# EAGLE design microlux (EAGLE 8.4.3)

## Sheet 1 of 3: Microcontoller, USB & ST4
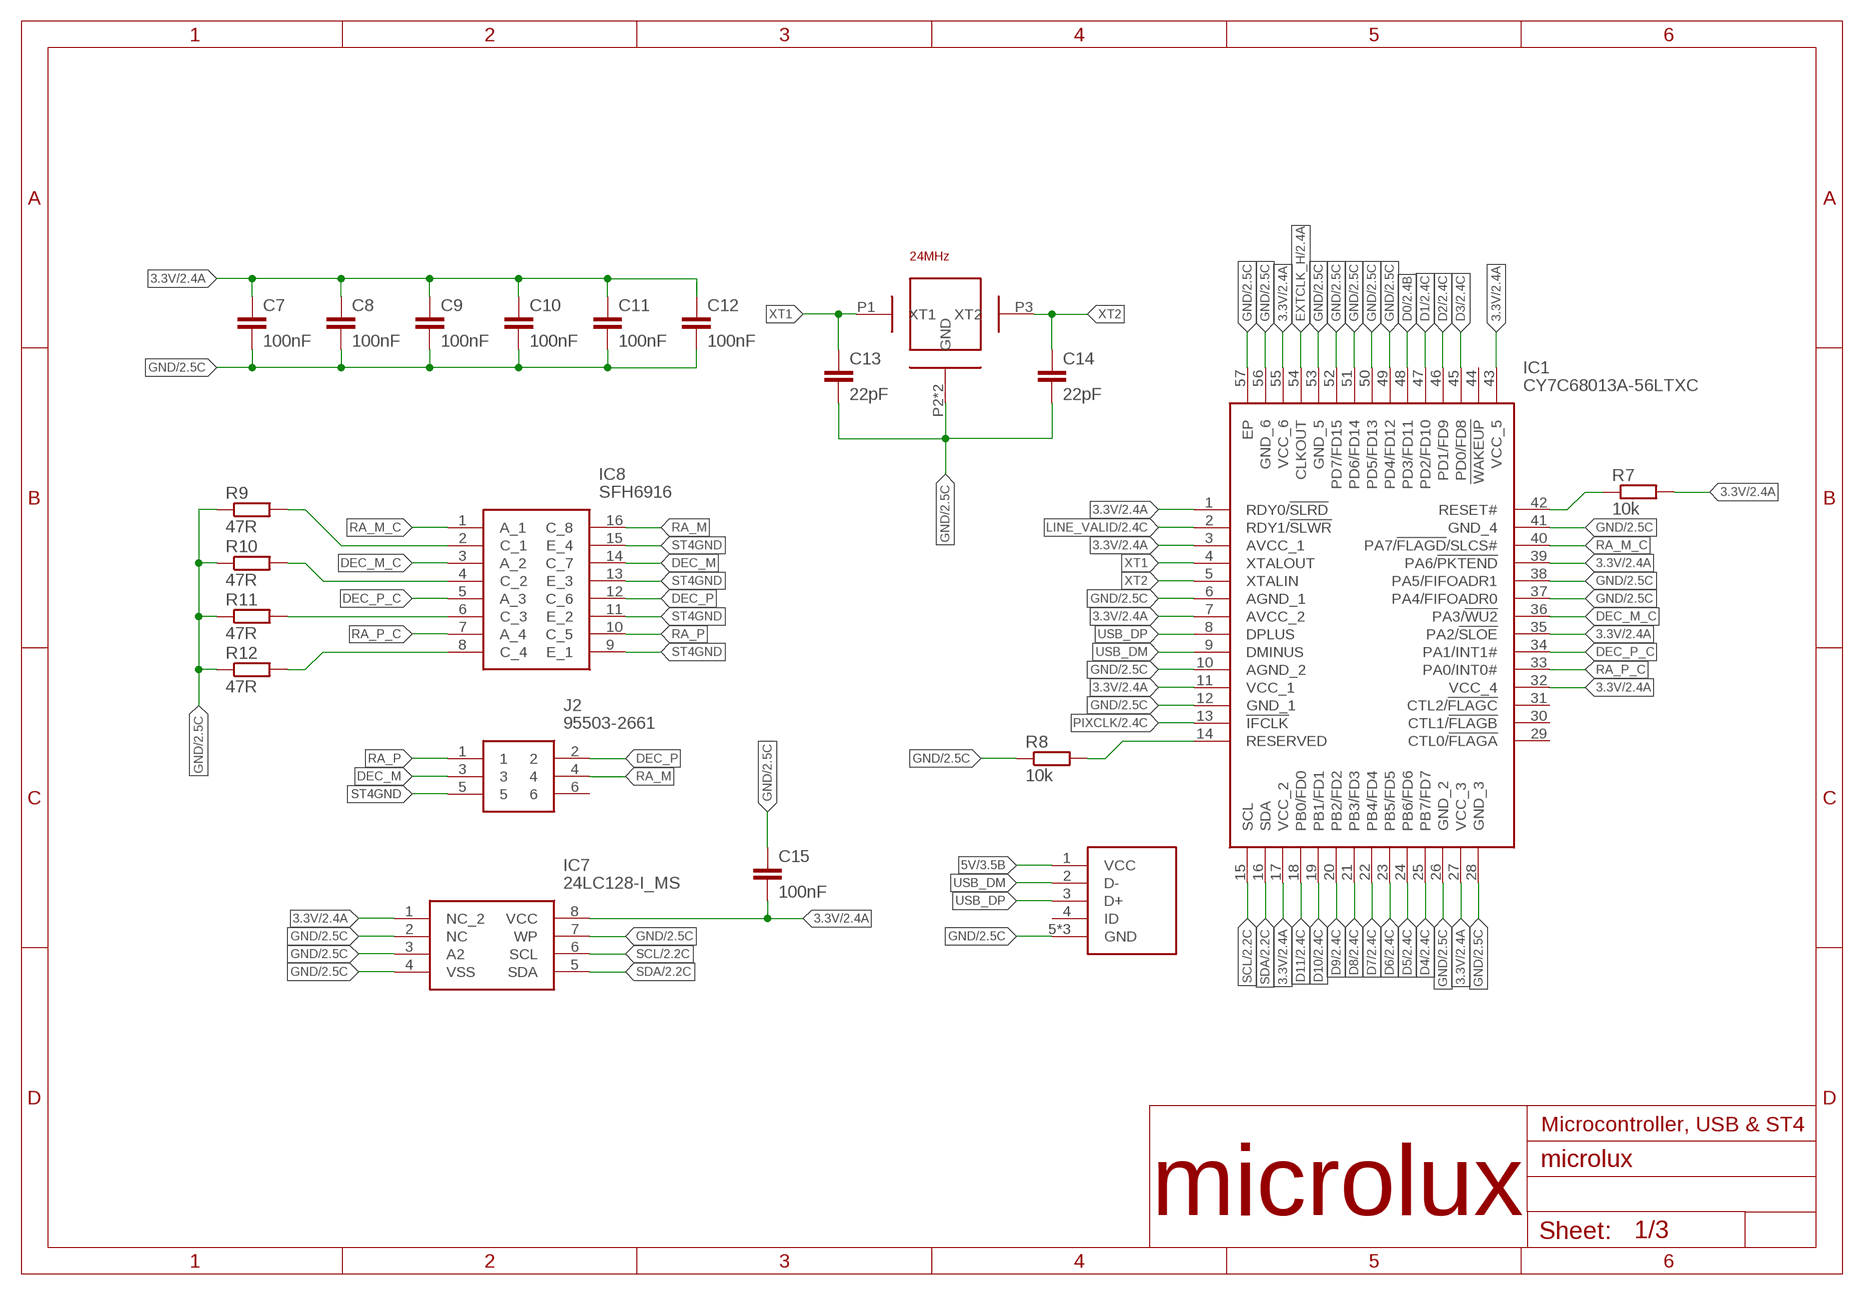
[diagram p0: schematic, sheet 1]

### Parts
C7  100nF  C-EUC0603  [C0603]
C8  100nF  C-EUC0603  [C0603]
C9  100nF  C-EUC0603  [C0603]
C10  100nF  C-EUC0603  [C0603]
C11  100nF  C-EUC0603  [C0603]
C12  100nF  C-EUC0603  [C0603]
C13  22pF  C-EUC0603  [C0603]
C14  22pF  C-EUC0603  [C0603]
C15  100nF  C-EUC0603  [C0603]
IC1  CY7C68013A-56LTXC  [QFN50P800X800X100-57N]
IC7  24LC128-I_MS  [SOP65P490X110-8N]
IC8  SFH6916  [SOIC127P686X216-16N]
J1  614105150621  [VMUSB]
J2  95503-2661  [955032661]
R7  10k  R-EU_R0603  [R0603]
R8  10k  R-EU_R0603  [R0603]
R9  47R  R-EU_R0603  [R0603]
R10  47R  R-EU_R0603  [R0603]
R11  47R  R-EU_R0603  [R0603]
R12  47R  R-EU_R0603  [R0603]
X1  24MHz  3.2X2.5_SHIELDED_CRYSTAL  [3.2X2.5]

### Nets
3.3V: C7.1 C8.1 C9.1 C10.1 C11.1 C12.1 C15.2 IC1.1(RDY0/!SLRD) IC1.3(AVCC_1) IC1.7(AVCC_2) IC1.11(VCC_1) IC1.17(VCC_2) IC1.27(VCC_3) IC1.32(VCC_4) IC1.35(PA2/!SLOE) IC1.39(PA6/!PKTEND) IC1.43(VCC_5) IC1.55(VCC_6) IC7.1(NC_2) IC7.8(VCC) R7.2 ; also sheet 2,3
5V: J1.1(VCC) ; also sheet 3
D0: IC1.48(PD3/FD11) ; also sheet 2
D1: IC1.47(PD2/FD10) ; also sheet 2
D2: IC1.46(PD1/FD9) ; also sheet 2
D3: IC1.45(PD0/FD8) ; also sheet 2
D4: IC1.25(PB7/FD7) ; also sheet 2
D5: IC1.24(PB6/FD6) ; also sheet 2
D6: IC1.23(PB5/FD5) ; also sheet 2
D7: IC1.22(PB4/FD4) ; also sheet 2
D8: IC1.21(PB3/FD3) ; also sheet 2
D9: IC1.20(PB2/FD2) ; also sheet 2
D10: IC1.19(PB1/FD1) ; also sheet 2
D11: IC1.18(PB0/FD0) ; also sheet 2
DEC_M: IC8.14(C_7) J2.3
DEC_M_C: IC1.36(PA3/!WU2) IC8.3(A_2)
DEC_P: IC8.12(C_6) J2.2
DEC_P_C: IC1.34(PA1/INT1#) IC8.5(A_3)
EXTCLK_H: IC1.54(CLKOUT) ; also sheet 2
GND: C7.2 C8.2 C9.2 C10.2 C11.2 C12.2 C13.2 C14.2 C15.1 IC1.6(AGND_1) IC1.10(AGND_2) IC1.12(GND_1) IC1.26(GND_2) IC1.28(GND_3) IC1.37(PA4/FIFOADR0) IC1.38(PA5/FIFOADR1) IC1.41(GND_4) IC1.49(PD4/FD12) IC1.50(PD5/FD13) IC1.51(PD6/FD14) IC1.52(PD7/FD15) IC1.53(GND_5) IC1.56(GND_6) IC1.57(EP) IC7.2(NC) IC7.3(A2) IC7.4(VSS) IC7.7(WP) J1.5(GND) J1.M1(GND) J1.M2(GND) R8.1 R9.1 R10.1 R11.1 R12.1 X1.P2(GND) X1.P4(GND) ; also sheet 2,3
LINE_VALID: IC1.2(RDY1/!SLWR) ; also sheet 2
N$1: IC1.14(RESERVED) R8.2
N$2: IC8.2(C_1) R9.2
N$4: IC1.42(RESET#) R7.1
N$5: IC8.4(C_2) R10.2
N$6: IC8.6(C_3) R11.2
N$7: IC8.8(C_4) R12.2
PIXCLK: IC1.13(!IFCLK) ; also sheet 2
RA_M: IC8.16(C_8) J2.4
RA_M_C: IC1.40(PA7/!FLAGD!/SLCS#) IC8.1(A_1)
RA_P: IC8.10(C_5) J2.1
RA_P_C: IC1.33(PA0/INT0#) IC8.7(A_4)
SCL: IC1.15(SCL) IC7.6(SCL) ; also sheet 2
SDA: IC1.16(SDA) IC7.5(SDA) ; also sheet 2
ST4GND: IC8.9(E_1) IC8.11(E_2) IC8.13(E_3) IC8.15(E_4) J2.5
USB_DM: IC1.9(DMINUS) J1.2(D-)
USB_DP: IC1.8(DPLUS) J1.3(D+)
XT1: C13.1 IC1.4(XTALOUT) X1.P1(XT1)
XT2: C14.1 IC1.5(XTALIN) X1.P3(XT2)
Unconnected: IC1.29(CTL0/!FLAGA) IC1.30(CTL1/!FLAGB) IC1.31(CTL2/!FLAGC) IC1.44(!WAKEUP) J1.4(ID) J2.6

### Notes on the sheet
- Microcontroller, USB & ST4
- microlux

## Sheet 2 of 3: Image sensor & LLS
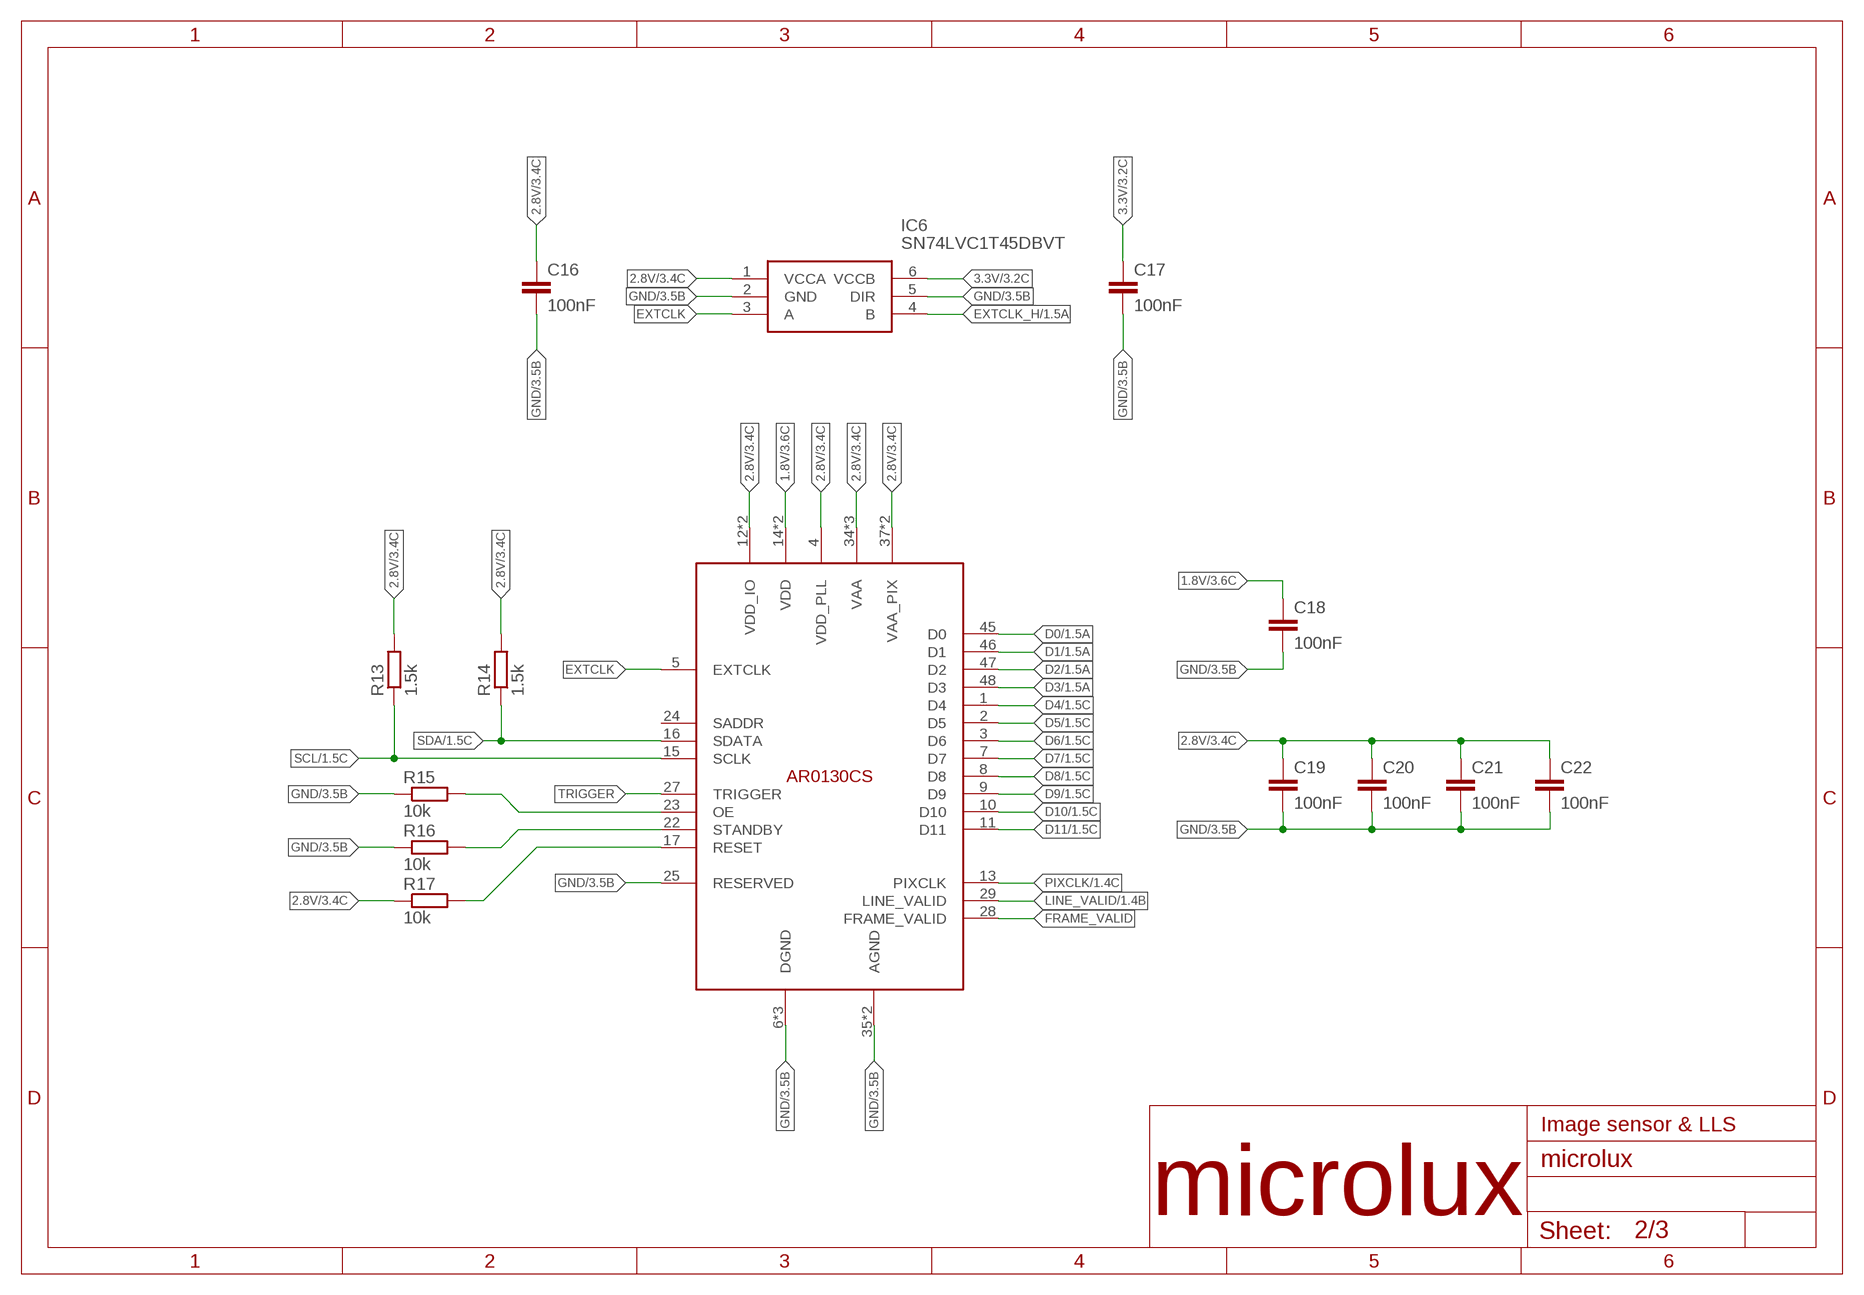
[diagram p1: schematic, sheet 2]

### Parts
C16  100nF  C-EUC0603  [C0603]
C17  100nF  C-EUC0603  [C0603]
C18  100nF  C-EUC0603  [C0603]
C19  100nF  C-EUC0603  [C0603]
C20  100nF  C-EUC0603  [C0603]
C21  100nF  C-EUC0603  [C0603]
C22  100nF  C-EUC0603  [C0603]
IC2  AR0130CS-ILCC48  [ILCC48]
IC6  SN74LVC1T45DBVT  [SOT95P280X145-6N]
R13  1.5k  R-EU_R0603  [R0603]
R14  1.5k  R-EU_R0603  [R0603]
R15  10k  R-EU_R0603  [R0603]
R16  10k  R-EU_R0603  [R0603]
R17  10k  R-EU_R0603  [R0603]

### Nets
1.8V: C18.1 IC2.14(VDD) IC2.19(VDD) ; also sheet 3
2.8V: C16.1 C19.1 C20.1 C21.1 C22.1 IC2.4(VDD_PLL) IC2.12(VDD_IO) IC2.18(VDD_IO) IC2.34(VAA) IC2.36(VAA) IC2.37(VAA_PIX) IC2.38(VAA_PIX) IC2.40(VAA) IC6.1(VCCA) R13.2 R14.2 R17.1 ; also sheet 3
3.3V: C17.1 IC6.6(VCCB) ; also sheet 1,3
D0: IC2.45(D0) ; also sheet 1
D1: IC2.46(D1) ; also sheet 1
D2: IC2.47(D2) ; also sheet 1
D3: IC2.48(D3) ; also sheet 1
D4: IC2.1(D4) ; also sheet 1
D5: IC2.2(D5) ; also sheet 1
D6: IC2.3(D6) ; also sheet 1
D7: IC2.7(D7) ; also sheet 1
D8: IC2.8(D8) ; also sheet 1
D9: IC2.9(D9) ; also sheet 1
D10: IC2.10(D10) ; also sheet 1
D11: IC2.11(D11) ; also sheet 1
EXTCLK: IC2.5(EXTCLK) IC6.3(A)
EXTCLK_H: IC6.4(B) ; also sheet 1
FRAME_VALID: IC2.28(FRAME_VALID)
GND: C16.2 C17.2 C18.2 C19.2 C20.2 C21.2 C22.2 IC2.6(DGND) IC2.25(RESERVED) IC2.30(DGND) IC2.35(AGND) IC2.39(AGND) IC2.44(DGND) IC6.2(GND) IC6.5(DIR) R15.1 R16.1 ; also sheet 1,3
LINE_VALID: IC2.29(LINE_VALID) ; also sheet 1
N$3: IC2.23(OE) R15.2
N$8: IC2.22(STANDBY) R16.2
N$21: IC2.17(RESET) R17.2
PIXCLK: IC2.13(PIXCLK) ; also sheet 1
SCL: IC2.15(SCLK) R13.1 ; also sheet 1
SDA: IC2.16(SDATA) R14.1 ; also sheet 1
TRIGGER: IC2.27(TRIGGER)
Unconnected: IC2.24(SADDR)

### Notes on the sheet
- Image sensor & LLS
- microlux

## Sheet 3 of 3: Voltage regulators
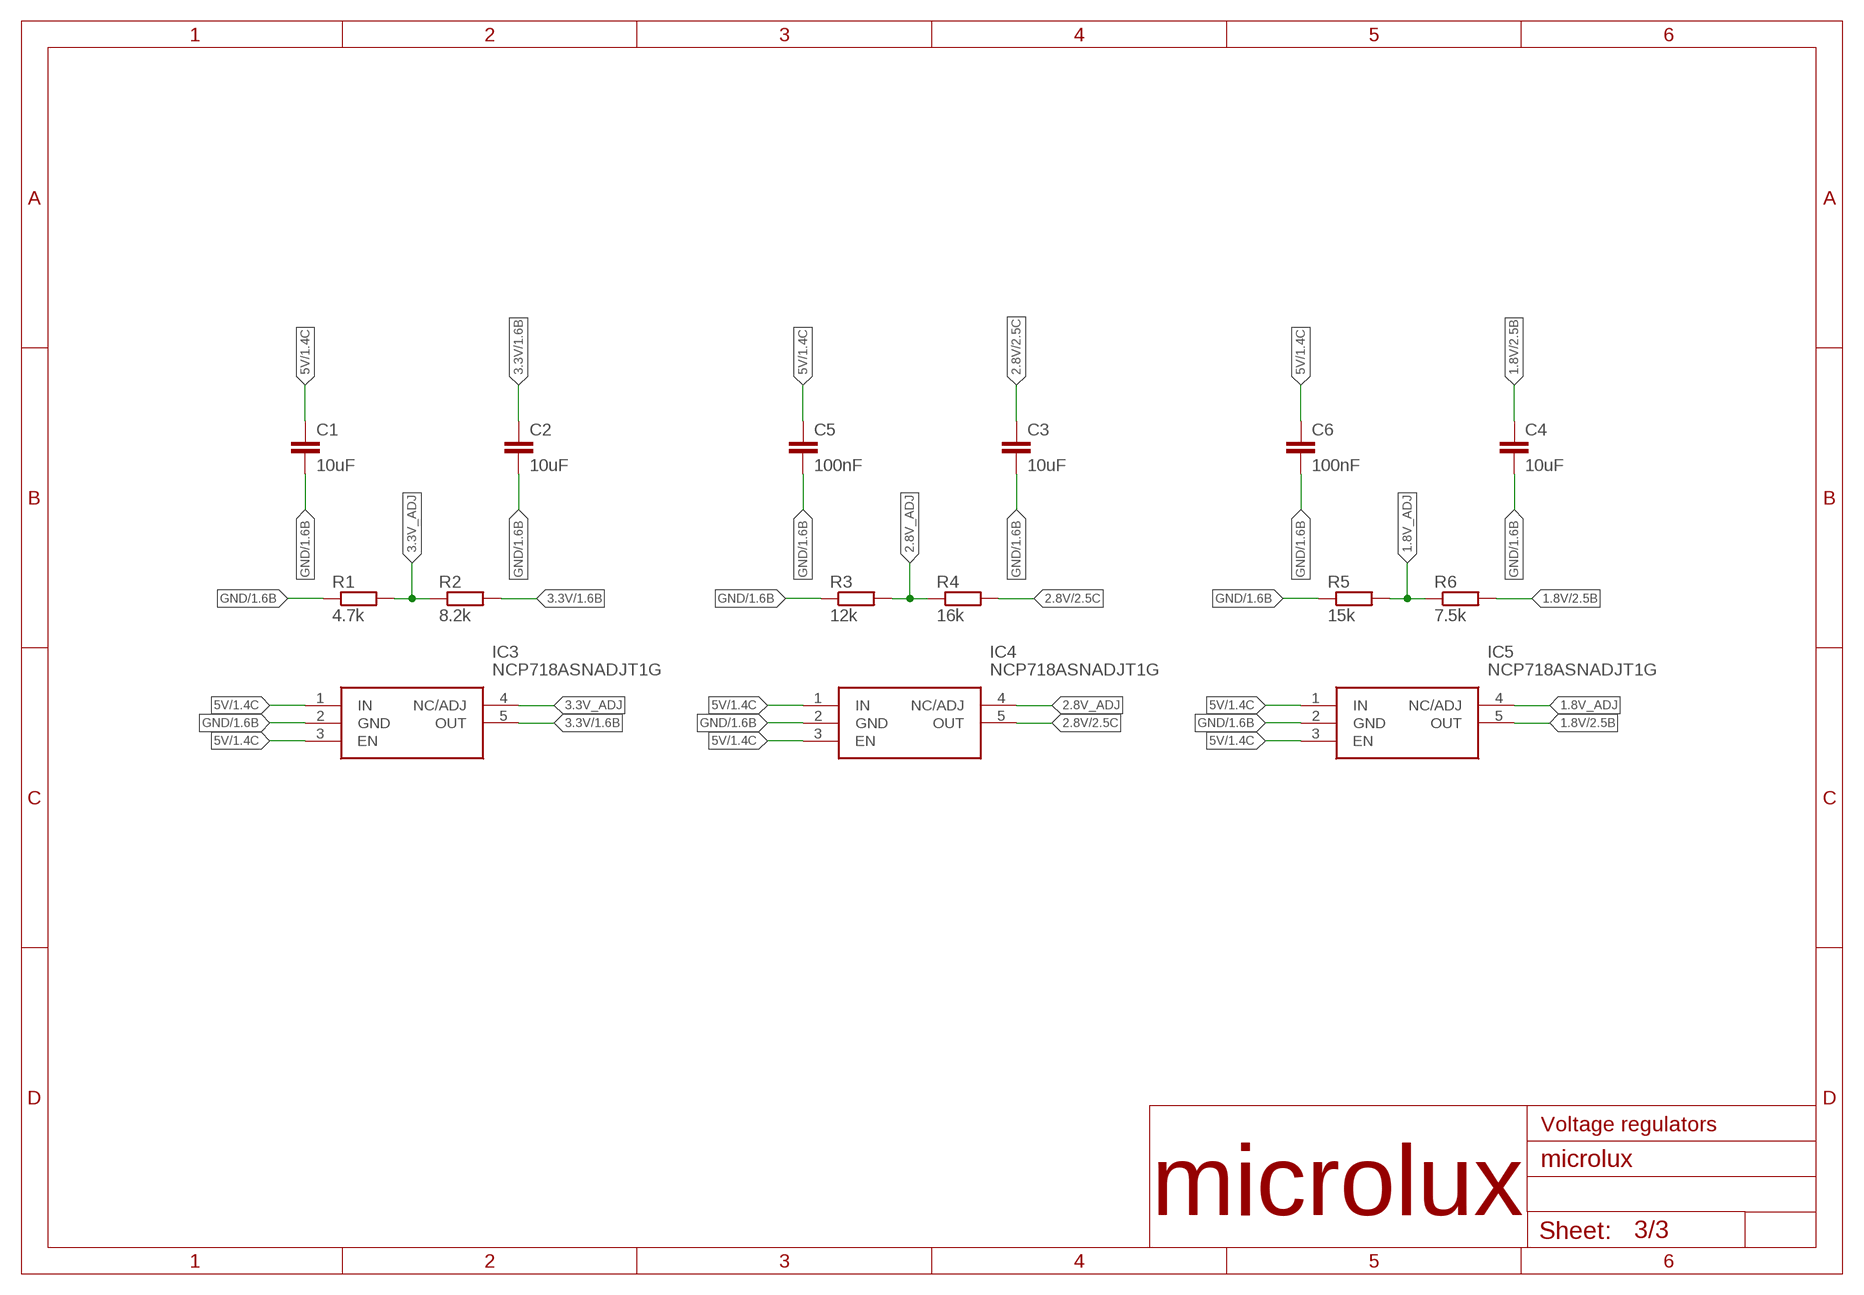
[diagram p2: schematic, sheet 3]

### Parts
C1  10uF  C-EUC1210  [C1210]
C2  10uF  C-EUC1210  [C1210]
C3  10uF  C-EUC1210  [C1210]
C4  10uF  C-EUC1210  [C1210]
C5  100nF  C-EUC0603  [C0603]
C6  100nF  C-EUC0603  [C0603]
IC3  NCP718ASNADJT1G  [SOT95P280X100-5N]
IC4  NCP718ASNADJT1G  [SOT95P280X100-5N]
IC5  NCP718ASNADJT1G  [SOT95P280X100-5N]
R1  4.7k  R-EU_R0603  [R0603]
R2  8.2k  R-EU_R0603  [R0603]
R3  12k  R-EU_R0603  [R0603]
R4  16k  R-EU_R0603  [R0603]
R5  15k  R-EU_R0603  [R0603]
R6  7.5k  R-EU_R0603  [R0603]

### Nets
1.8V: C4.1 IC5.5(OUT) R6.2 ; also sheet 2
1.8V_ADJ: IC5.4(NC/ADJ) R5.2 R6.1
2.8V: C3.1 IC4.5(OUT) R4.2 ; also sheet 2
2.8V_ADJ: IC4.4(NC/ADJ) R3.2 R4.1
3.3V: C2.1 IC3.5(OUT) R2.2 ; also sheet 1,2
3.3V_ADJ: IC3.4(NC/ADJ) R1.2 R2.1
5V: C1.1 C5.1 C6.1 IC3.1(IN) IC3.3(EN) IC4.1(IN) IC4.3(EN) IC5.1(IN) IC5.3(EN) ; also sheet 1
GND: C1.2 C2.2 C3.2 C4.2 C5.2 C6.2 IC3.2(GND) IC4.2(GND) IC5.2(GND) R1.1 R3.1 R5.1 ; also sheet 1,2

### Notes on the sheet
- Voltage regulators
- microlux

## Library data of the parts
C1-C22 = rcl:C-EU: CAPACITOR, European symbol
IC1 = CY7C68013A-56LTXC:CY7C68013A-56LTXC: Cypress Semiconductor CY7C68013A-56LTXC, USB Controller, 480MBps, USB 2.0, 3.3 V, 56-Pin QFN Source: Datasheet <http://www.arrow.com/en/products/cy7c68013a-56ltxc/cypress-semiconductor>; ARROW_PART_NUMBER: CY7C68013A-56LTXC; ARROW_PRICE-STOCK: https://www.arrow.com/en/products/cy7c68013a-56ltxc/cypress-semiconductor; DESCRIPTION: Cypress Semiconductor CY7C68013A-56LTXC, USB Controller, 480MBps, USB 2.0, 3.3 V, 56-Pin QFN; HEIGHT: 1mm; MANUFACTURER_NAME: Cypress Semiconductor; MANUFACTURER_PART_NUMBER: CY7C68013A-56LTXC; RS_PART_NUMBER: 1254136P; RS_PRICE-STOCK: http://uk.rs-online.com/web/p/products/1254136P
IC2 = ar0130cs:AR0130CS-ILCC48
IC3-IC5 = NCP718ASNADJT1G:NCP718ASNADJT1G: LDO Regulator, 300 mA, Low Iq, Wide Input Voltage Adjustable, Active Discharge Source: Datasheet <http://www.onsemi.com/pub/Collateral/NCP718-D.PDF>; ARROW_PART_NUMBER: NCP718ASNADJT1G; ARROW_PRICE-STOCK: https://www.arrow.com/en/products/ncp718asnadjt1g/on-semiconductor; DESCRIPTION: LDO Regulator, 300 mA, Low Iq, Wide Input Voltage Adjustable, Active Discharge; HEIGHT: 1mm; MANUFACTURER_NAME: ON Semiconductor; MANUFACTURER_PART_NUMBER: NCP718ASNADJT1G; RS_PART_NUMBER: 1723327; RS_PRICE-STOCK: http://uk.rs-online.com/web/p/products/1723327
IC6 = SN74LVC1T45DBVT:SN74LVC1T45DBVT: Single-Bit Dual-Supply Bus Transceiver with Configurable Voltage-Level Shifting and 3-State Outputs Source: Datasheet <http://www.ti.com/lit/ds/symlink/sn74lvc1t45.pdf>; DESCRIPTION: Single-Bit Dual-Supply Bus Transceiver with Configurable Voltage-Level Shifting and 3-State Outputs; HEIGHT: 1.45mm; MANUFACTURER_NAME: Texas Instruments; MANUFACTURER_PART_NUMBER: SN74LVC1T45DBVT; MOUSER_PART_NUMBER: 595-SN74LVC1T45DBVT; MOUSER_PRICE-STOCK: https://www.mouser.com/Search/Refine.aspx?Keyword=595-SN74LVC1T45DBVT; RS_PART_NUMBER: 9222846; RS_PRICE-STOCK: http://uk.rs-online.com/web/p/products/9222846
IC7 = 24LC128-I_MS:24LC128-I_MS: 128K I2C CMOS Serial EEPROM Source: Datasheet <http://componentsearchengine.com/Datasheets/1/24LC128-I_MS.pdf>; ALLIED_NUMBER: 70045853; ALLIED_PRICE-STOCK: https://www.alliedelec.com/microchip-technology-inc-24lc128-i-ms/70045853/; ARROW_PART_NUMBER: 24LC128-I/MS; ARROW_PRICE-STOCK: https://www.arrow.com/en/products/24lc128-ims/microchip-technology; DESCRIPTION: 128K I2C CMOS Serial EEPROM; HEIGHT: mm; MANUFACTURER_NAME: Microchip; MANUFACTURER_PART_NUMBER: 24LC128-I/MS; RS_PART_NUMBER: 2509532705; RS_PRICE-STOCK: http://uk.rs-online.com/web/p/products/2509532705
IC8 = SFH6916:SFH6916: Optocoupler DC-IN 4-CH Trans DC-OUT Source: Datasheet <http://www.vishay.com/docs/83687/sfh6916.pdf>; ALLIED_NUMBER: R1084757; ALLIED_PRICE-STOCK: https://www.alliedelec.com/vishay-dale-sfh6916/R1084757/; ARROW_PART_NUMBER: SFH6916; ARROW_PRICE-STOCK: https://www.arrow.com/en/products/sfh6916/vishay; DESCRIPTION: Optocoupler DC-IN 4-CH Trans DC-OUT; HEIGHT: 2.16mm; MANUFACTURER_NAME: Vishay; MANUFACTURER_PART_NUMBER: SFH6916; RS_PART_NUMBER: 7085522P; RS_PRICE-STOCK: http://uk.rs-online.com/web/p/products/7085522P
J1 = vertusb:614105150621
J2 = 95503-2661:95503-2661: Molex 95503 Series 6 Way Straight Through Hole Unshielded RJ11 Jack 2661 Source: Datasheet <https://www.molex.com/pdm_docs/sd/955032661_sd.pdf>; ALLIED_NUMBER: 70091112; ALLIED_PRICE-STOCK: https://www.alliedelec.com/molex-incorporated-95503-2661/70091112/; ARROW_PART_NUMBER: 95503-2661; ARROW_PRICE-STOCK: http://uk.rs-online.com/web/p/products/8223220; DESCRIPTION: Molex 95503 Series 6 Way Straight Through Hole Unshielded RJ11 Jack 2661; HEIGHT: 15.7mm; MANUFACTURER_NAME: Molex; MANUFACTURER_PART_NUMBER: 95503-2661; RS_PART_NUMBER: 8223220; RS_PRICE-STOCK: http://uk.rs-online.com/web/p/products/8223220
R1-R17 = rcl:R-EU_: RESISTOR, European symbol
X1 = osc:3.2X2.5_SHIELDED_CRYSTAL

## Board
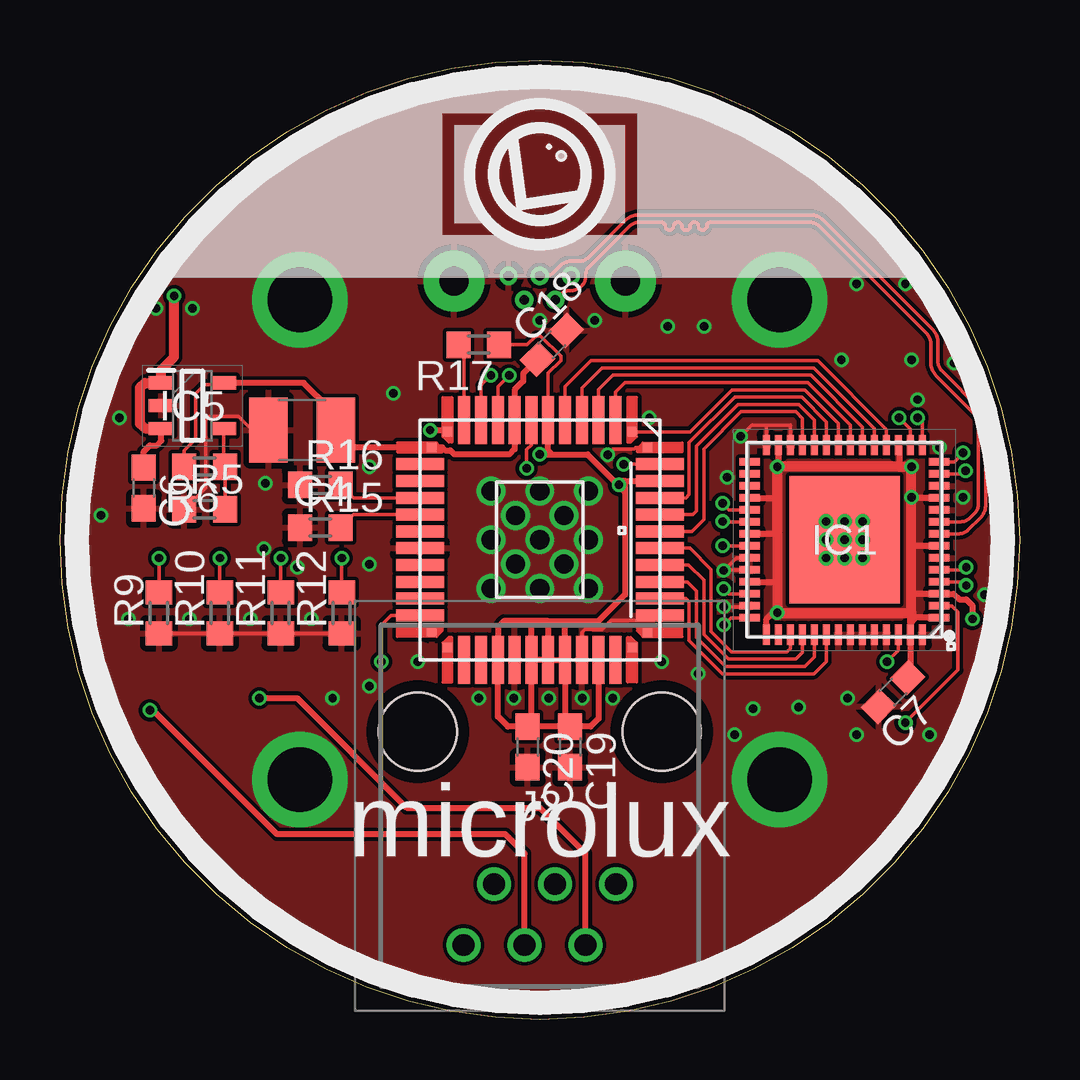
[diagram p3: board, top side]
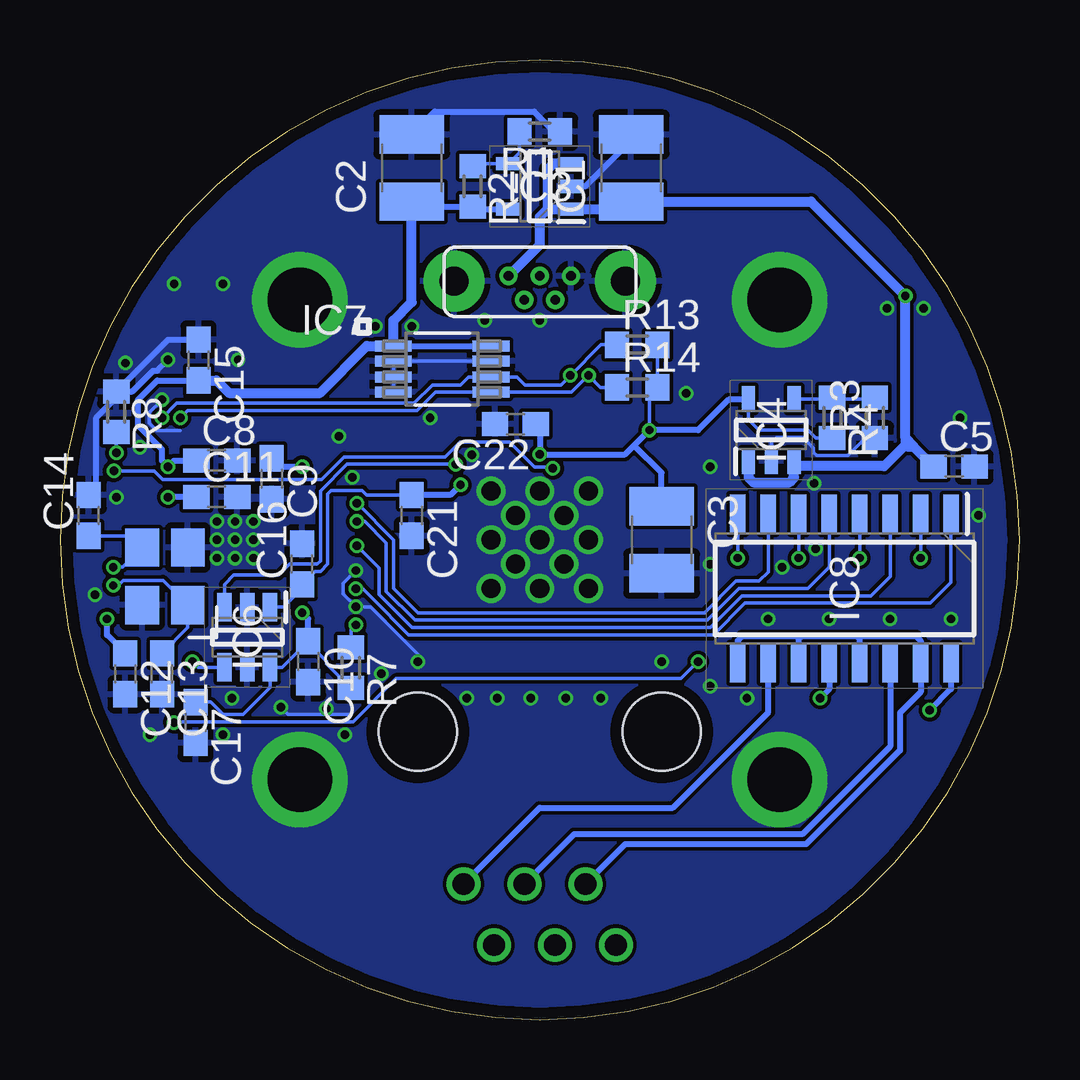
[diagram p4: board, bottom side, seen from below]

Size 40 x 40 mm. Coordinates in mm from the lower left corner, seen from the top.
Outline: 20,40 arc-90 40,20 arc-90 20,0 arc-90 0,20 arc-90 20,40
Copper layers (1*16): Top 0.035mm / dielectric 1.5mm / Bottom 0.035mm
Design rules "default *": minimum track width 6mil, minimum drill 0.35mm, track to track 6mil, track to pad 6mil, pad to pad 6mil, via to via 6mil, smd to smd 6mil, copper to edge 20mil, drill to drill 6mil, minimum pad ring 5mil, minimum via ring 5mil, stop-mask expansion 4mil, vias tented up to drill 15mil, thermal gap 10mil

### Footprints (pad centres in the part's own frame; a part is rotated, then mirrored left to right if it is on the bottom)
C1210 = smd 1.6 x 2.7: 1 -1.4,0; 2 1.4,0
C0603 = smd 1.1 x 1: 1 -0.85,0; 2 0.85,0
QFN50P800X800X100-57N = smd 0.85 x 0.3: 1 -3.95,3.25; 2 -3.95,2.75; 3 -3.95,2.25; 4 -3.95,1.75; 5 -3.95,1.25; 6 -3.95,0.75; 7 -3.95,0.25; 8 -3.95,-0.25; 9 -3.95,-0.75; 10 -3.95,-1.25; 11 -3.95,-1.75; 12 -3.95,-2.25; 13 -3.95,-2.75; 14 -3.95,-3.25; 29 3.95,-3.25; 30 3.95,-2.75; 31 3.95,-2.25; 32 3.95,-1.75; 33 3.95,-1.25; 34 3.95,-0.75; 35 3.95,-0.25; 36 3.95,0.25; 37 3.95,0.75; 38 3.95,1.25; 39 3.95,1.75; 40 3.95,2.25; 41 3.95,2.75; 42 3.95,3.25 | smd 0.3 x 0.85: 15 -3.25,-3.95; 16 -2.75,-3.95; 17 -2.25,-3.95; 18 -1.75,-3.95; 19 -1.25,-3.95; 20 -0.75,-3.95; 21 -0.25,-3.95; 22 0.25,-3.95; 23 0.75,-3.95; 24 1.25,-3.95; 25 1.75,-3.95; 26 2.25,-3.95; 27 2.75,-3.95; 28 3.25,-3.95; 43 3.25,3.95; 44 2.75,3.95; 45 2.25,3.95; 46 1.75,3.95; 47 1.25,3.95; 48 0.75,3.95; 49 0.25,3.95; 50 -0.25,3.95; 51 -0.75,3.95; 52 -1.25,3.95; 53 -1.75,3.95; 54 -2.25,3.95; 55 -2.75,3.95; 56 -3.25,3.95 | smd 4.6 x 5.3: 57 0,0
ILCC48 = smd 0.5 x 2: 1 -0.35,5; 2 -1.05,5; 3 -1.75,5; 4 -2.45,5; 5 -3.15,5; 20 -3.15,-5; 21 -2.45,-5; 22 -1.75,-5; 23 -1.05,-5; 24 -0.35,-5; 25 0.35,-5; 26 1.05,-5; 27 1.75,-5; 28 2.45,-5; 29 3.15,-5; 44 3.15,5; 45 2.45,5; 46 1.75,5; 47 1.05,5; 48 0.35,5 | smd 0.4 x 0.4: 6 -3.85,4.5; 7 -4.5,3.85; 18 -4.5,-3.85; 19 -3.85,-4.5; 30 3.85,-4.5; 31 4.5,-3.85; 42 4.5,3.85; 43 3.85,4.5 | smd 2 x 0.5: 8 -5,3.15; 9 -5,2.45; 10 -5,1.75; 11 -5,1.05; 12 -5,0.35; 13 -5,-0.35; 14 -5,-1.05; 15 -5,-1.75; 16 -5,-2.45; 17 -5,-3.15; 32 5,-3.15; 33 5,-2.45; 34 5,-1.75; 35 5,-1.05; 36 5,-0.35; 37 5,0.35; 38 5,1.05; 39 5,1.75; 40 5,2.45; 41 5,3.15
SOT95P280X100-5N = smd 1.05 x 0.55: 1 -1.3,0.95; 2 -1.3,0; 3 -1.3,-0.95; 4 1.3,-0.95; 5 1.3,0.95
SOT95P280X145-6N = smd 1.2 x 0.6: 1 -1.25,0.95; 2 -1.25,0; 3 -1.25,-0.95; 4 1.25,-0.95; 5 1.25,0; 6 1.25,0.95
SOP65P490X110-8N = smd 1.524 x 0.457: 1 -2.032,0.965; 2 -2.032,0.33; 3 -2.032,-0.33; 4 -2.032,-0.965; 5 2.032,-0.965; 6 2.032,-0.33; 7 2.032,0.33; 8 2.032,0.965
SOIC127P686X216-16N = smd 1.638 x 0.65: 1 -3.106,4.445; 2 -3.106,3.175; 3 -3.106,1.905; 4 -3.106,0.635; 5 -3.106,-0.635; 6 -3.106,-1.905; 7 -3.106,-3.175; 8 -3.106,-4.445; 9 3.106,-4.445; 10 3.106,-3.175; 11 3.106,-1.905; 12 3.106,-0.635; 13 3.106,0.635; 14 3.106,1.905; 15 3.106,3.175; 16 3.106,4.445
VMUSB = drill 0.4 pad 0.762: 1 -1.3,1; 2 -0.65,0; 3 0,1; 4 0.65,0; 5 1.3,1 | drill 1.2 pad 2.54: M1 -3.575,0.78; M2 3.575,0.78
955032661 = drill 0.9 pad 1.4: 1 0,0; 2 1.27,2.54; 3 2.54,0; 4 3.81,2.54; 5 5.08,0; 6 6.35,2.54 | hole 3.25: -1.905,-6.35; 8.255,-6.35
R0603 = smd 1 x 1.1: 1 -0.85,0; 2 0.85,0
3.2X2.5 = smd 1.6 x 1.4: P1 -1.2,-0.95; P2 1.2,-0.95; P3 1.2,0.95; P4 -1.2,0.95

### Placement (x,y rotation side)
C1  16.19,35.49 90 bottom
C2  25.33,35.49 90 bottom
C3  14.92,20 270 bottom
C4  10.09,24.57 180 top
C5  2.73,23.05 0 bottom
C6  3.49,22.16 270 top
C7  34.73,13.65 225 top
C8  33.46,23.3 0 bottom
C9  31.18,22.54 270 bottom
C10  29.65,14.92 270 bottom
C11  33.46,21.78 0 bottom
C12  37.27,14.41 270 bottom
C13  35.75,14.41 270 bottom
C14  38.8,21.02 90 bottom
C15  34.22,27.49 270 bottom
C16  29.91,18.98 90 bottom
C17  34.35,12.38 270 bottom
C18  20.51,28.13 45 top
C19  21.27,11.36 270 top
C20  19.49,11.36 270 top
C21  25.33,21.02 270 bottom
C22  21.02,24.83 180 bottom
IC1  32.7,20 180 top
IC2  20,20 270 top
IC3  20,34.73 180 bottom
IC4  10.35,24.57 90 bottom
IC5  5.52,25.59 0 top
IC6  32.19,15.94 270 bottom
IC7  24.06,27.11 0 bottom
IC8  7.3,17.97 270 bottom
J1  20,30 0 bottom
J2  23.18,5.65 180 top
R1  20,37.02 180 bottom
R2  22.79,34.73 270 bottom
R3  6.03,25.08 90 bottom
R4  7.81,25.08 270 bottom
R5  6.03,21.27 0 top
R6  6.03,23.05 180 top
R7  27.87,14.67 270 bottom
R8  37.65,25.33 270 bottom
R9  4.12,16.95 90 top
R10  6.66,16.95 90 top
R11  9.21,16.95 90 top
R12  11.74,16.95 90 top
R13  15.94,28.13 0 bottom
R14  15.94,26.35 0 bottom
R15  10.86,20.51 0 top
R16  10.86,22.29 0 top
R17  17.46,28.13 180 top
X1  35.62,18.48 90 bottom

### Tracks (layer width: path | path; a pad name or v marks a point on that pad's centre or on a via)
1.8V
  Top 0.152: R6.2 5.18,23.72 5.65,24.19 5.65,26.1 6.03,26.48 6.76,26.48 IC5.5
  Top 0.254: IC5.5 10.16,26.54 11.24,25.46 11.24,24.83 C4.1 12.22,23.85 IC2.19 15.93,23.85 16.06,23.72 16.28,23.72 16.44,23.56 18.73,23.56 18.95,23.78 IC2.14 18.95,26.25 19.31,26.61 19.31,26.93 C18.1
1.8V_ADJ
  Top 0.152: IC5.4 6.82,23.11 R6.1 R5.2
2.8V  (via drill 0.35, 0.35 pad 0.6)
  Top 0.152: R17.1 19.48,28.13 19.85,28.5 20.04,28.5 20.88,27.66 20.88,27.47 20.35,26.94 IC2.12
  Top 0.254: 23.56,21.99 23.56,17.71 22.45,16.61 21.05,16.61 | 23.56,22.29 23.56,21.99 | IC2.38 21.05,16.61 | 19.65,16.61 18.5,16.61 18.25,16.35 IC2.34 18.25,12.63 18.67,12.21 C20.1 19.65,12.37 | 20.35,16.61 19.65,16.61 | 20.35,16.61 21.05,16.61 | IC2.36 19.65,16.61 | 20.35,16.61 IC2.37 | 20.35,23.71 20.51,23.56 | 20.35,23.71 IC2.12 | 20.51,23.56 21.99,23.56 23.1,22.45 | 20.35,23.71 20.19,23.56 v20,23.56 20.51,23.56 | v15.43,24.57 16.08,24.57 IC2.18 | 23.56,22.45 23.1,22.45 | 23.56,22.45 IC2.4 | 23.56,21.99 23.26,22.29 | 23.56,22.29 23.56,22.45 | 23.1,22.45 23.26,22.29 | 23.26,22.29 v23.3,22.29 23.56,22.29 | 19.65,12.37 IC2.36 | IC2.38 21.05,12.43 C19.1 | IC2.37 IC2.38 | IC2.37 IC2.36 | IC2.40 22.45,12.54 22.12,12.21 C19.1 | C19.1 19.81,12.21 19.65,12.37
  Bottom 0.152: R13.2 R14.2 15.43,26.01 v15.43,24.57 | R4.2 8.48,24.23 8.82,24.57 10.86,24.57 11.3,25.01 IC4.5 | 31.22,17.21 30.67,17.21 29.91,17.97 | C21.1 27.21,21.87 27.4,22.05 28.69,22.05 28.84,21.91 28.84,18.98 29.14,18.68 29.36,18.68 C16.1
  Bottom 0.254: 16.06,23.94 v15.43,24.57 13.4,24.57 12.13,25.84 11.33,25.84 IC4.5 | 16.06,23.94 16.44,23.56 v20,23.56 20,24.66 C22.1 | 16.06,23.94 14.92,22.79 C3.1 | IC6.1 31.22,17.21 | 29.91,17.97 C16.1 | v23.3,22.29 23.72,21.87 C21.1
2.8V_ADJ
  Bottom 0.152: 7.87,25.87 IC4.4 | 7.87,25.87 R4.1 | R3.2 6.09,25.87 7.87,25.87
3.3V  (via drill 0.35, 0.35 pad 0.6)
  Top 0.254: IC1.27 29.95,23.09 v29.91,23.05 | IC1.32 29.88,21.75 29.91,21.78 | IC1.17 34.99,23.91 34.99,23.05 | IC1.7 35.5,19.75 35.49,19.75 | 35.49,17.71 35.53,17.75 IC1.3 37.25,17.75 37.48,17.51 37.78,17.51 38.03,17.26 v38.03,16.7 37.98,16.75 | IC1.1 36.22,16.75 35.69,16.75 | 35.69,16.75 35.49,16.95 35.45,16.91 35.45,16.52 | 35.45,16.52 IC1.55 35.45,14.37 C7.1 | IC1.43 29.45,16.48 29.45,16.7 29.7,16.95 v29.91,16.95 | IC1.39 29.88,18.25 29.91,18.22 | IC1.11 35.52,21.75 v35.49,21.78 | 35.69,16.75 35.68,16.75 35.45,16.52 | IC1.35 29.91,20.25
  Top 0.406: 34.99,23.05 v29.91,23.05 29.91,21.78 29.91,20.25 29.91,18.22 v29.91,16.95 35.49,16.95 35.49,17.71 35.49,19.75 v35.49,21.78 v35.49,23.05 34.99,23.05
  Bottom 0.152: 29.7,15.73 30.74,14.69 IC6.6 31.24,13.84 32.36,12.72 33.21,12.72 33.72,13.23 C17.1 | 29.7,15.73 C10.1 | R7.2 28.89,14.83 28.89,14.92 29.7,15.73
  Bottom 0.254: C2.1 25.12,33.88 R2.2 22.69,33.78 IC3.5 | C12.1 38.03,16.02 v38.03,16.7 | IC7.1 26.1,28.13 26.05,28.08 IC7.8 | C9.1 30.83,23.05 v29.91,23.05 | C11.1 v35.49,21.78 | v29.91,16.95 29.65,16.7 C10.1 | C8.1 35.24,23.3 v35.49,23.05 35.74,23.3 35.74,23.76 36.75,24.77 36.75,25.84 35.95,26.64 C15.2
  Bottom 0.406: C2.1 25.33,29.91 26.1,29.14 IC7.1 27.21,28.08 29.16,26.12 32.95,26.12 33.48,26.64 C15.2
  pour Top: 29.14,23.56 36.26,23.56 36.26,16.44 29.14,16.44
3.3V_ADJ
  Bottom 0.152: R1.2 20.85,36.13 IC3.4 22.69,35.68 R2.1
5V  (via drill 0.35)
  Top 0.254: IC5.3 4.22,24.13 4.03,23.94 3.74,23.94 3.49,23.68 C6.1
  Top 0.406: IC5.3 3.55,24.64 3.34,24.84 3.34,26.34 3.55,26.54 IC5.1 4.22,27.08 4.76,27.62 v4.76,30.16
  Bottom 0.406: J1.1 20,32.3 20,33.46 19.68,33.78 | 19.68,33.78 IC3.1 16.5,33.78 C1.1 8.69,34.09 v4.76,30.16 4.76,24.23 | IC3.3 19.43,35.68 19.68,35.43 19.68,33.78 | 4.76,24.23 4.76,23.95 | 4.76,23.95 5.64,23.07 9.2,23.07 IC4.3 9.4,22.59 9.6,22.39 11.1,22.39 11.3,22.59 IC4.1 | 4.42,23.89 C5.1 | 4.42,23.89 4.76,24.23 | 4.76,23.95 4.71,23.89 4.42,23.89
D0
  Top 0.152: IC2.45 26.1,17.55 26.23,17.42 26.23,15.8 27.62,14.41 31.43,14.41 31.94,14.92 31.94,16.04 IC1.48
D1
  Top 0.152: IC1.47 31.45,15.12 31.05,14.72 27.75,14.72 26.53,15.93 26.53,17.87 26.15,18.25 IC2.46
D2
  Top 0.152: IC1.46 30.95,15.3 30.67,15.02 27.87,15.02 26.84,16.06 26.84,18.32 26.2,18.95 IC2.47
D3
  Top 0.152: IC1.45 30.45,15.46 30.31,15.33 28,15.33 27.14,16.18 27.14,18.76 26.25,19.65 IC2.48
D4
  Top 0.152: IC1.25 30.95,25.05 30.67,25.33 28.38,25.33 26.84,23.79 26.84,20.84 26.35,20.35 IC2.1
D5
  Top 0.152: IC1.24 31.45,24.98 30.79,25.64 28.26,25.64 26.53,23.92 26.53,21.2 26.38,21.05 IC2.2
D6
  Top 0.152: IC1.23 31.95,24.91 30.92,25.94 28.13,25.94 26.23,24.04 26.23,21.88 26.1,21.75 IC2.3
D7
  Top 0.152: IC2.7 26.25,24.5 28,26.25 31.05,26.25 32.45,24.84 IC1.22
D8
  Top 0.152: IC1.21 32.95,24.78 31.17,26.55 23.56,26.55 23.15,26.15 IC2.8
D9
  Top 0.152: IC2.9 22.45,26.26 23.05,26.86 31.3,26.86 33.45,24.71 IC1.20
D10
  Top 0.152: IC2.10 21.75,26.32 22.59,27.16 31.43,27.16 33.95,24.64 IC1.19
D11
  Top 0.152: IC2.11 21.05,26.38 22.13,27.47 31.59,27.47 34.45,24.6 IC1.18
DEC_M
  Bottom 0.254: IC8.14 5.39,11.38 9.06,7.72 18.56,7.72 J2.3
DEC_M_C  (via drill 0.35)
  Top 0.152: IC1.36 v27.62,19.75
  Bottom 0.152: v27.62,19.75 26.71,18.83 26.71,17.71 25.33,16.34 12.89,16.34 11.57,17.66 6.21,17.66 5.39,18.48 IC8.3
DEC_P  (via drill 0.35 pad 0.6)
  Top 0.254: J2.2 21.91,6.92 20,8.82 14.46,8.82 9.88,13.4 v8.32,13.4
  Bottom 0.254: IC8.12 7.94,13.78 v8.32,13.4
DEC_P_C  (via drill 0.35)
  Top 0.152: IC1.34 27.63,20.75 v27.62,20.76
  Bottom 0.152: v27.62,20.76 27.29,20.76 26.4,19.87 26.4,17.84 25.21,16.65 13.02,16.65 11.7,17.97 8.82,17.97 7.94,18.86 IC8.5
EXTCLK  (via drill 0.35)
  Top 0.152: IC2.5 v23.5,23.15
  Bottom 0.152: v23.5,23.15 28.03,23.15 29.14,22.03 29.14,19.11 29.27,18.98 30.43,18.98 30.89,18.52 32.76,18.52 33.14,18.14 IC6.3
EXTCLK_H  (via drill 0.35)
  Top 0.152: IC1.54 34.95,15.39 v34.48,14.92
  Bottom 0.152: v34.48,14.92 34.24,14.69 IC6.4
GND  (via drill 0.35, 0.35 pad 0.6, 0.8, 2.7 pad 4)
  Top 0.152: IC1.26 30.45,24.77 29.45,24.77 | 29.45,24.77 IC1.28 | 29.45,24.77 28.84,24.77 v28.38,24.32 | IC1.41 28.71,17.21 v27.67,17.21 | 27.7,18.75 IC1.38 | 27.7,18.75 v27.67,18.72 | IC1.37 28.2,19.25 27.7,18.75 | IC2.6 24,23.85 23.92,23.77 23.05,23.77 v22.83,23.55 | R12.1 R11.1 R10.1 R9.1 | IC2.44 24.78,16.63 22.97,16.63 22.6,16.25 21.88,16.25 21.75,16.12 IC2.39 | C4.2 8.01,24.57 7.44,25.14 6.2,25.14 6.07,25.01 6.07,22.16 R5.1
  Bottom 0.152: R3.1 6.44,24.23 7.16,23.5 8.45,23.5 8.59,23.63 8.59,23.83 9.03,24.27 10.14,24.27 10.35,24.06 IC4.2 | v27.67,18.72 v27.67,18.71 28.2,18.18 28.2,17.74 v27.67,17.21 27.06,17.21 25.08,15.23 v25.08,14.92 | IC7.7 IC7.2 IC7.3 IC7.4 | v30.8,13.02 30.5,12.72 27.92,12.72 | 34.99,24.55 35.97,24.55 36.28,24.86 36.28,25.3 v35.75,25.83 v35.75,25.84
  Bottom 0.254: IC3.2 18.1,34.73 16.19,36.64 C1.2 | R1.1 19.41,37.02 20.23,37.85 24.38,37.85 C2.2 | R8.1 37.65,25.93 38.48,25.1 38.48,22.18 C14.2 | R8.1 35.49,28.34 C15.1 | R8.1 36.98,26.18 36.11,27.05 35.94,27.05 v35.49,27.49
  other vias: 17.97,20 18.98,18.98 20,17.97 21.02,18.98 22.03,20 21.02,21.02 20,22.03 18.98,21.02 20,20 10,10 30,10 10,30 30,30 17.97,17.97 22.03,17.97 22.03,22.03 17.97,22.03 27.81,22.6 14.92,14.92 12.89,23.05 24.57,25.08 32.7,20 31.94,20.76 32.7,20.76 33.46,20.76 33.46,20 33.46,19.24 32.7,19.24 31.94,19.24 31.94,20 12.89,13.9 28.13,11.87 21.78,13.4 20.38,13.4 18.92,13.4 36.66,23.86 38.54,17.71 1.71,21.02 2.47,25.08 8.51,19.62 9.9,18.86 8.57,22.35 13.9,26.1 37.65,21.78 17.46,13.4 23.05,13.4 20,29.14 22.29,29.14 32.83,13.4 32.57,27.49 25.33,28.89 26.86,28.89 37.27,27.37 4,29.65 5.52,29.65 35.24,30.67 33.21,30.67 12.89,18.98 11.36,13.4 2.86,16.7 5.39,16.7 7.94,16.7 10.47,16.7 33.21,11.87 36.26,11.87 26.6,14.41 28.89,12.95
  pour Bottom: 0,40 40,40 40,0 0,0
  pour Top (rank 6): 20,40 40,40 40,0 0,0 0,40
LINE_VALID  (via drill 0.35 pad 0.6)
  Top 0.152: v13.4,14.92 13.4,16.44 13.8,16.85 IC2.29 | IC1.2 37.17,17.25 37.43,17 37.43,14.57 v35.24,12.38
  Bottom 0.152: v13.4,14.92 14.11,14.21 26,14.21 27.79,12.41 35.21,12.41 v35.24,12.38
N$1  (via drill 0.35 pad 0.6)
  Top 0.152: v37.65,23.63 37.28,23.25 IC1.14
  Bottom 0.152: v37.65,23.63 R8.2
N$2  (via drill 0.35)
  Top 0.152: v4.12,19.24 R9.2
  Bottom 0.152: IC8.2 v4.12,19.24
N$3
  Top 0.152: IC2.23 12.25,21.05 R15.2
N$4  (via drill 0.35)
  Top 0.152: IC1.42 27.97,16.75 v27.67,16.45
  Bottom 0.152: v27.67,16.45 27.87,16.25 R7.1
N$5  (via drill 0.35)
  Top 0.152: v6.66,19.24 R10.2
  Bottom 0.152: IC8.4 v6.66,19.24
N$6  (via drill 0.35)
  Top 0.152: v9.21,19.24 R11.2
  Bottom 0.152: IC8.6 v9.21,19.24
N$7  (via drill 0.35)
  Top 0.152: v11.74,19.24 R12.2
  Bottom 0.152: IC8.8 v11.74,19.24
N$8
  Top 0.152: IC2.22 12.24,21.75 R16.2
N$21
  Top 0.152: IC2.17 16.85,27.89 R17.2
PIXCLK  (via drill 0.35, 0.35 pad 0.6)
  Top 0.152: IC1.13 37.64,22.75 v37.76,22.87 | IC2.13 19.65,23.96 19.45,23.76 v19.45,22.98
  Bottom 0.152: v37.76,22.87 36.07,22.87 35.71,22.52 29.09,22.52 28.15,23.45 23.95,23.45 23.32,24.08 21.27,24.08 20.22,23.02 19.5,23.02 v19.45,22.98
RA_M  (via drill 0.35 pad 0.6)
  Top 0.254: v3.74,12.89 3.89,12.89 9.06,7.72 18.56,7.72 19.36,6.92 J2.4
  Bottom 0.254: IC8.16 2.86,13.78 v3.74,12.89
RA_M_C  (via drill 0.35)
  Top 0.152: IC1.40 27.89,17.75 v27.67,17.96
  Bottom 0.152: IC8.1 2.86,18.22 3.72,17.36 11.44,17.36 12.76,16.04 25.46,16.04 27,17.57 | 27,17.57 27.13,17.71 | v27.67,17.96 27.38,17.96 27,17.57
RA_P
  Bottom 0.254: IC8.10 10.47,12.8 14.46,8.82 20,8.82 J2.1
RA_P_C  (via drill 0.35)
  Top 0.152: IC1.33 27.89,21.25 v27.62,21.52
  Bottom 0.152: v27.62,21.52 26.1,20 26.1,17.97 25.08,16.95 13.14,16.95 11.82,18.27 10.86,18.27 10.47,18.65 IC8.7
SCL  (via drill 0.35)
  Top 0.152: IC1.15 35.95,24.88 v35.75,25.08 | v18.72,26.85 18.25,26.38 IC2.15
  Bottom 0.152: R13.1 17.45,28.13 v18.72,26.85 19.12,26.45 20.61,26.45 20.94,26.78 IC7.6 22.97,26.78 23.3,26.45 24.48,26.45 25.24,25.69 35.14,25.69 v35.75,25.08
SDA  (via drill 0.35)
  Top 0.152: IC1.16 35.45,24.62 v34.99,25.08 | v17.97,26.86 17.55,26.44 IC2.16
  Bottom 0.152: R14.1 17.46,26.35 v17.97,26.86 18.68,26.15 IC7.5 24.35,26.15 25.11,25.38 34.68,25.38 v34.99,25.08
ST4GND
  Bottom 0.254: 9.08,15.96 11.57,15.96 11.74,15.78 IC8.9 | 6.79,15.96 9.08,15.96 | IC8.11 9.21,15.96 9.08,15.96 | IC8.13 6.66,15.96 6.79,15.96 | 6.79,15.96 4.3,15.96 4.12,15.78 IC8.15 4.12,13.65 4.99,12.79 4.99,11.21 8.89,7.31 16.43,7.31 J2.5
USB_DM
  Top 0.152: J1.2 20.89,30.24 arc-45 21.25,30.39 21.34,30.39 arc45 21.7,30.54 21.76,30.6 arc45 21.91,30.96 21.91,31.02 arc-45 22.06,31.38 23.76,33.08 arc-45 24.12,33.23 25.08,33.23 arc-90 25.23,33.08 25.23,33.07 arc90 25.38,32.91 25.43,32.91 arc90 25.58,33.07 25.58,33.08 arc-90 25.73,33.23 25.77,33.23 arc-90 25.92,33.08 25.92,33.07 arc90 26.08,32.91 26.12,32.91 arc90 26.27,33.07 26.27,33.08 arc-90 26.42,33.23 26.46,33.23 arc-90 26.61,33.08 26.61,33.07 arc90 26.77,32.91 26.81,32.91 arc90 26.96,33.07 26.96,33.08 arc-90 27.11,33.23 31.28,33.23 arc-45 31.64,33.08 36.15,28.57 arc-45 36.3,28.21 36.3,27.41 arc45 36.53,26.83 38.14,25.23 arc-45 38.29,24.87 38.29,21.48 arc-45 38.14,21.12 37.92,20.9 arc-45 37.56,20.75 IC1.9
USB_DP
  Top 0.152: J1.3 20.23,31 arc45 20.59,31.15 20.9,31.46 arc-45 21.26,31.61 21.64,31.61 arc45 22,31.76 23.54,33.3 arc-45 24.12,33.54 31.28,33.54 arc-45 31.85,33.3 36.36,28.79 arc-45 36.6,28.21 36.6,27.41 arc45 36.75,27.05 38.41,25.38 arc-45 38.59,24.95 | 38.59,24.95 | 38.59,24.95 38.59,21.48 arc-45 38.36,20.91 37.85,20.4 arc-45 37.49,20.25 IC1.8
XT1  (via drill 0.35)
  Top 0.152: IC1.4 37.62,18.25 v37.78,18.09
  Bottom 0.152: v37.78,18.09 37.58,18.09 37.37,18.3 35.7,18.3 X1.P1 34.67,16.34 C13.1
XT2  (via drill 0.35)
  Top 0.152: v37.78,18.86 37.67,18.75 IC1.5
  Bottom 0.152: v37.78,18.86 37.39,18.86 X1.P3 37.06,20.17 C14.1

### Text on the board
tPlace: microlux